# Altium schematic sheet MCU.SchDoc
size 420 x 297 mm; Author: ALTIUM GOSTBOM2.0 KEV; SheetNumber: 2; SheetTotal: 3
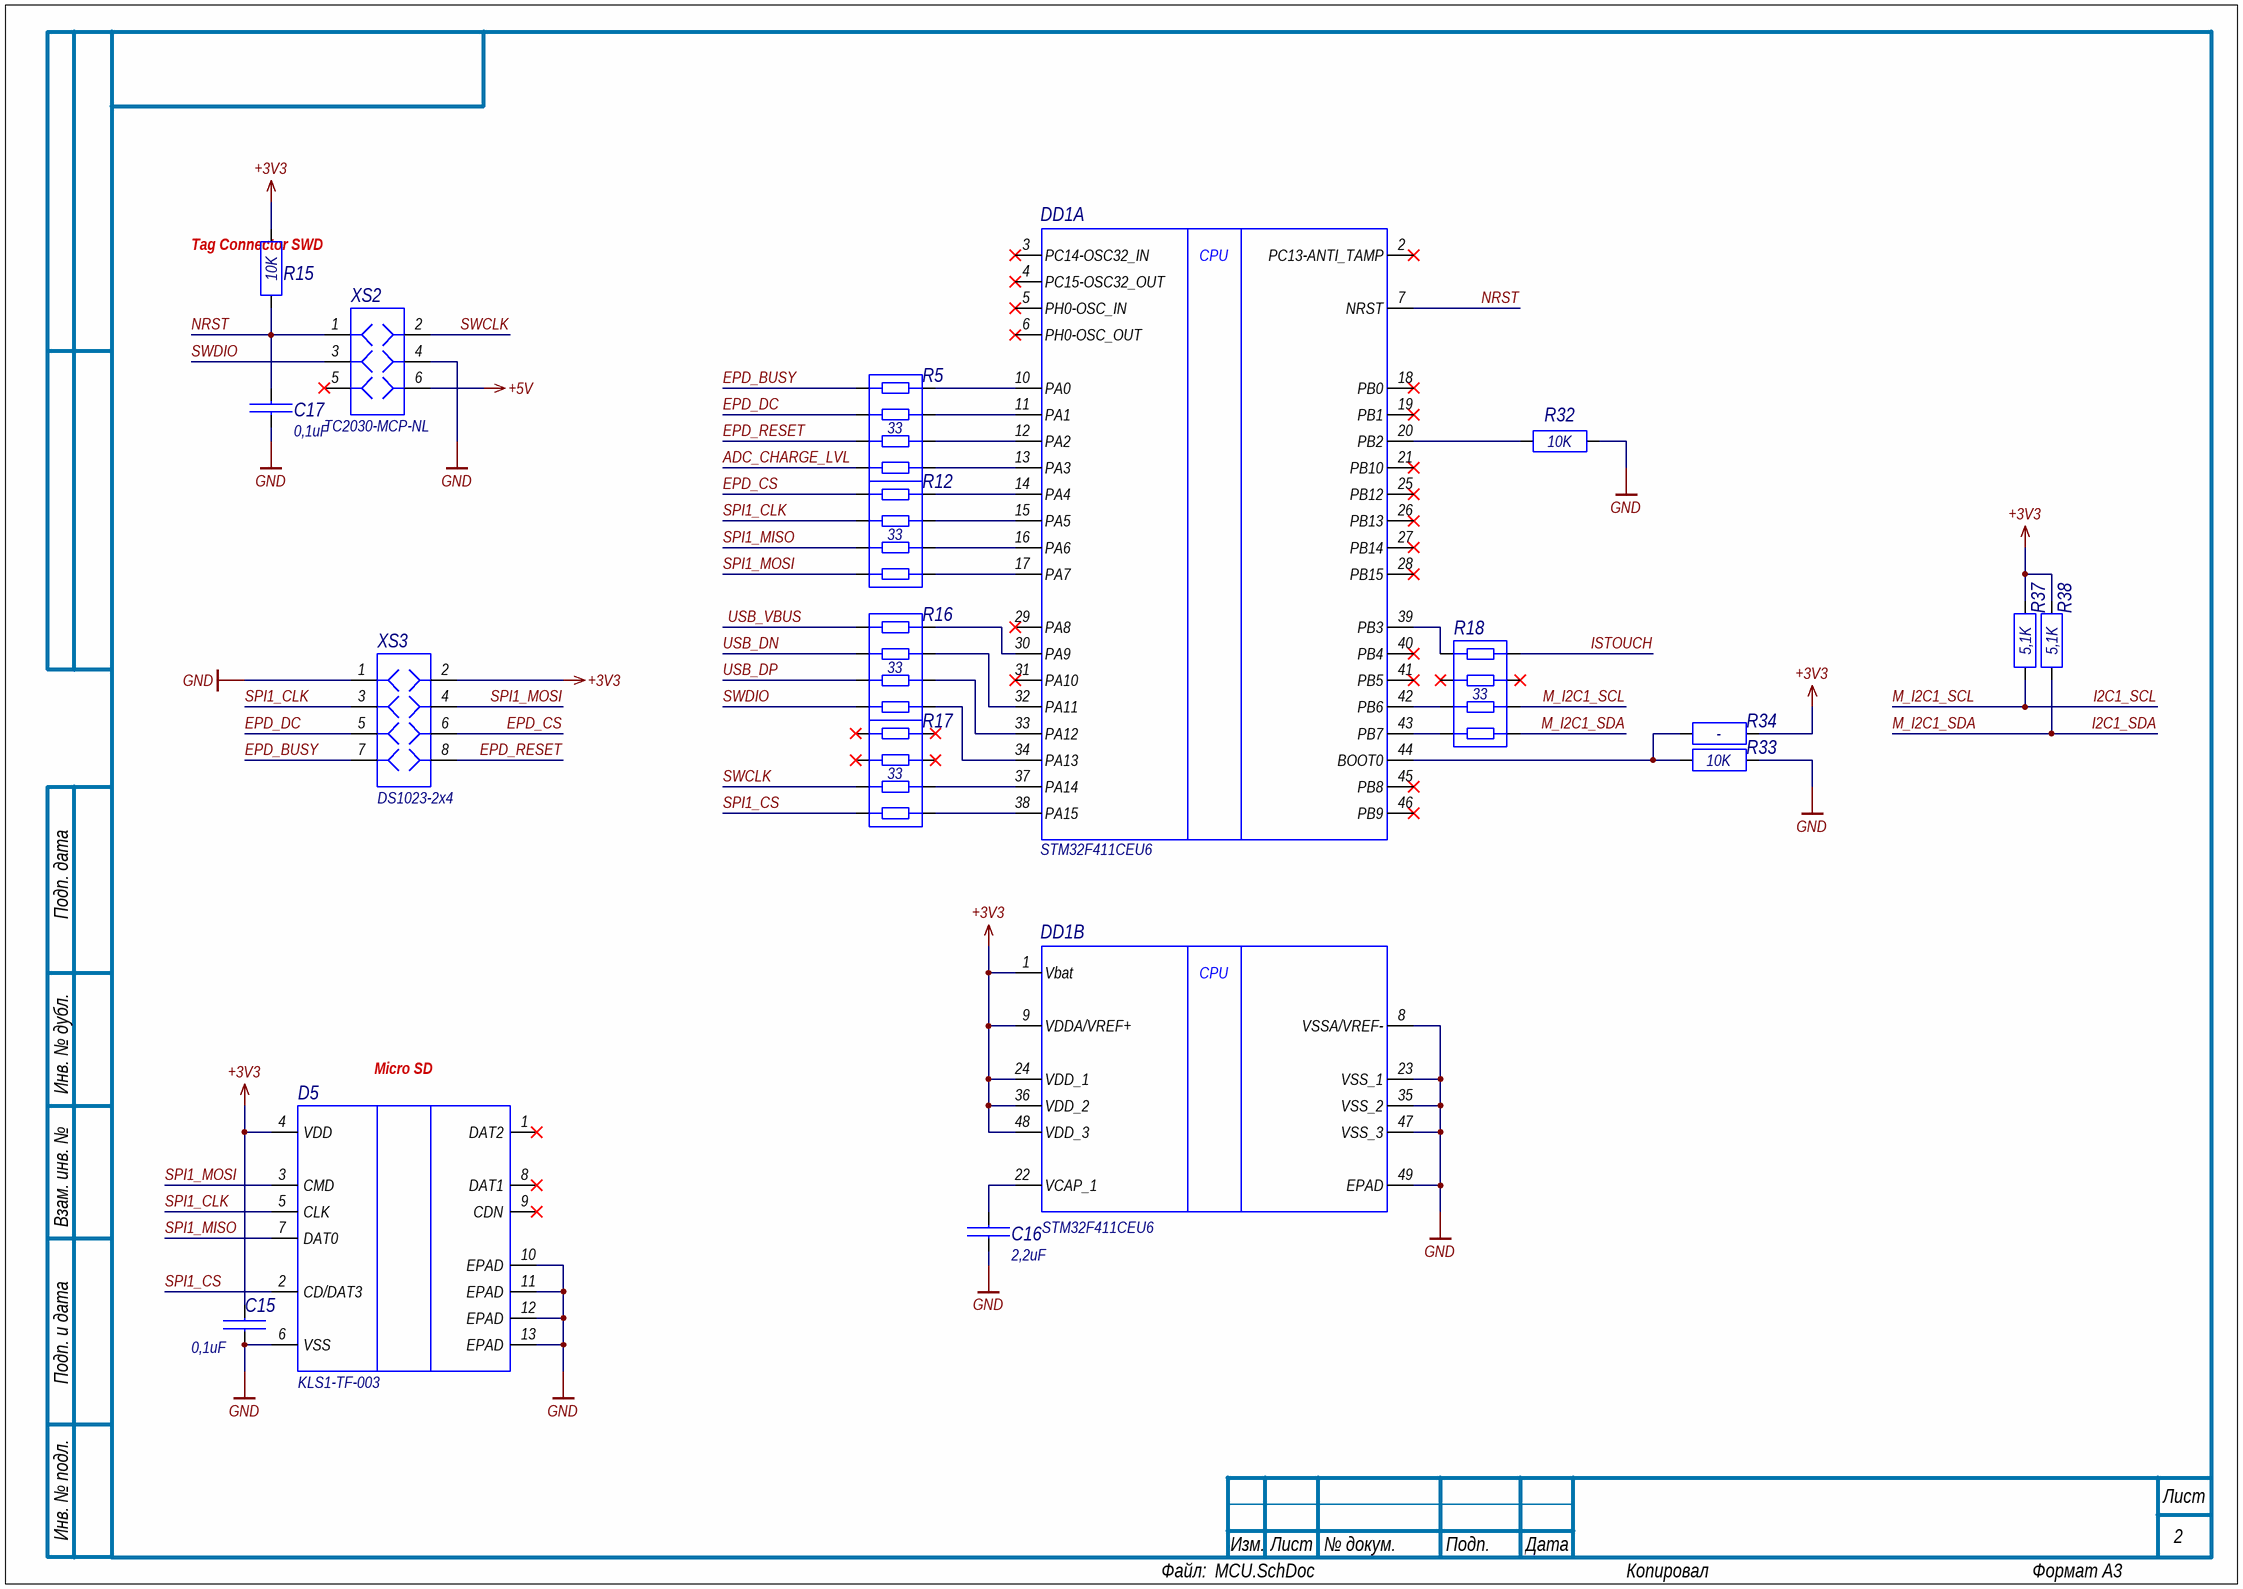
[diagram p0: MCU.SchDoc]

## Parts
C15  value 0,1uF  [CAP_0603]  (hidden comment: CAPACITOR)
C16  value 2,2uF  [CAP_0603]  (hidden comment: CAPACITOR)
C17  value 0,1uF  [CAP_0603]  (hidden comment: CAPACITOR)
D5  KLS1-TF-003  [KLS1-TF-003]
DD1  STM32F411CEU6  [UFQFPN48]  (parts A,B of 2)
R5  value 33  [RES_ARRAY_0804_CONVEX]  (hidden comment: RESISTOR_ARRAY)
R12  value 33  [RES_ARRAY_0804_CONVEX]  (hidden comment: RESISTOR_ARRAY)
R15  value 10K  [RES_0603]  (hidden comment: RESISTOR)
R16  value 33  [RES_ARRAY_0804_CONVEX]  (hidden comment: RESISTOR_ARRAY)
R17  value 33  [RES_ARRAY_0804_CONVEX]  (hidden comment: RESISTOR_ARRAY)
R18  value 33  [RES_ARRAY_0804_CONVEX]  (hidden comment: RESISTOR_ARRAY)
R32  value 10K  [RES_0603]  (hidden comment: RESISTOR)
R33  value 10K  [RES_0603]  (hidden comment: RESISTOR)
R34  RESISTOR  [RES_0603]  (value not drawn)  (no BOM)
R37  value 5,1K  [RES_0603]  (hidden comment: RESISTOR)
R38  value 5,1K  [RES_0603]  (hidden comment: RESISTOR)
XS2  value TC2030-MCP-NL  [TC2030-MCP-NL]  (hidden comment: HEADER-3x2-F)
XS3  value DS1023-2x4  [PBD-8]  (hidden comment: HEADER-4x2-F)

## Nets
+3V3: C15.1 D5.4(VDD) DD1.1(Vbat) DD1.9(VDDA/VREF+) DD1.24(VDD_1) DD1.36(VDD_2) DD1.48(VDD_3) R15.2 R34.2 R37.2 R38.2 XS3.2
+5V: XS2.6
GND: C15.2 C16.2 C17.2 D5.6(VSS) D5.10(EPAD) D5.11(EPAD) D5.12(EPAD) D5.13(EPAD) DD1.8(VSSA/VREF-) DD1.23(VSS_1) DD1.35(VSS_2) DD1.47(VSS_3) DD1.49(EPAD) R32.2 R33.2 XS2.4 XS3.1
ADC_CHARGE_LVL: R5.4
EPD_BUSY: R5.1 XS3.7
EPD_CS: R12.1 XS3.6
EPD_DC: R5.2 XS3.5
EPD_RESET: R5.3 XS3.8
I2C1_SCL: R18.7 R37.1  [also labelled M_I2C1_SCL]
I2C1_SDA: R18.8 R38.1  [also labelled M_I2C1_SDA]
ISTOUCH: R18.5
NRST: C17.1 DD1.7(NRST) R15.1 XS2.1
SPI1_CLK: D5.5(CLK) R12.2 XS3.3
SPI1_CS: D5.2(CD/DAT3) R17.4
SPI1_MISO: D5.7(DAT0) R12.3
SPI1_MOSI: D5.3(CMD) R12.4 XS3.4
SWCLK: R17.3 XS2.2
SWDIO: R16.4 XS2.3
USB_DN: R16.2
USB_DP: R16.3
USB_VBUS: R16.1
NetC16_1: C16.1 DD1.22(VCAP_1)
NetDD1_10: DD1.10(PA0) R5.8
NetDD1_11: DD1.11(PA1) R5.7
NetDD1_12: DD1.12(PA2) R5.6
NetDD1_13: DD1.13(PA3) R5.5
NetDD1_14: DD1.14(PA4) R12.8
NetDD1_15: DD1.15(PA5) R12.7
NetDD1_16: DD1.16(PA6) R12.6
NetDD1_17: DD1.17(PA7) R12.5
NetDD1_20: DD1.20(PB2) R32.1
NetDD1_30: DD1.30(PA9) R16.8
NetDD1_32: DD1.32(PA11) R16.7
NetDD1_33: DD1.33(PA12) R16.6
NetDD1_34: DD1.34(PA13) R16.5
NetDD1_37: DD1.37(PA14) R17.6
NetDD1_38: DD1.38(PA15) R17.5
NetDD1_39: DD1.39(PB3) R18.4
NetDD1_42: DD1.42(PB6) R18.2
NetDD1_43: DD1.43(PB7) R18.1
NetDD1_44: DD1.44(BOOT0) R33.1 R34.1

Not connected (* = marked no-connect by the designer): D5 1(DAT2)* 8(DAT1)* 9(CDN)*; DD1 2(PC13-ANTI_TAMP)* 3(PC14-OSC32_IN)* 4(PC15-OSC32_OUT)* 5(PH0-OSC_IN)* 6(PH0-OSC_OUT)* 18(PB0)* 19(PB1)* 21(PB10)* 25(PB12)* 26(PB13)* 27(PB14)* 28(PB15)* 29(PA8)* 31(PA10)* 40(PB4)* 41(PB5)* 45(PB8)* 46(PB9)*; R17 1* 2* 7* 8*; R18 3* 6*; XS2 5*

## Notes on the sheet
- Tag Connector SWD
- (near D5) Micro SD
- Подп. дата
- Инв. № дубл.
- Взам. инв. №
- Подп. и дата
- Инв. № подл.
- Изм.
- Лист
- № докум.
- Подп.
- Дата
- Файл:
- Копировал
- Формат А3
- (in symbol STM32F411CEU6, part A) CPU
- (in symbol STM32F411CEU6, part B) CPU

## Library data of the parts
C15 C17 = CAP_CER_0603_104_25_10_X7R: Ceramic Capacitor SMD_0603 X7R; Manufacturer: Yageo; Manufacturer Part Number: CC0603KRX7R8BB104; Voltage: 25V; Tolerance: 10%; Part Number: CAP_CER_0603_104_25_10_X7R; Part Type: 0603; Size: 0603; Dielectric: X7R
C16 = CAP_CER_0603_225_10_10_X5R: Ceramic Capacitor SMD_0603 X5R; Manufacturer: Yageo; Manufacturer Part Number: CC0603KRX5R6BB225; Voltage: 10V; Tolerance: 10%; Part Number: CAP_CER_0603_225_10_10_X5R; Part Type: 0603; Size: 0603; Dielectric: X5R
D5 = KLS1-TF-003: microSD Card Connector; Manufacturer: KLS; Value: KLS1-TF-003; Part Number: KLS1-TF-003; Part Type: CARD; Manufacturer Part Number: KLS1-TF-003
DD1 = STM32F411CEU6: Arm Cortex-M4 32b MCU+FPU, 125 DMIPS, 512KB Flash, / 128KB RAM, USB OTG FS, 11 TIMs, 1 ADC, 13 comm. interfaces; Manufacturer_Name: STMicroelectronics; Geometry.Height: 0.6mm; Manufacturer_Part_Number: STM32F411CEU6; Mouser Part Number: 511-STM32F411CEU6; Mouser Price/Stock: https://www.mouser.co.uk/ProductDetail/STMicroelectronics/STM32F411CEU6?qs=pjMTYa9MTGV3ou31YBFa3g%3D%3D; Arrow Part Number: STM32F411CEU6; Arrow Price/Stock: https://www.arrow.com/en/products/stm32f411ceu6/stmicroelectronics?utm_currency=USD&region=nac; Datasheet Link: http://www.st.com/content/ccc/resource/technical/document/datasheet/b3/a5/46/3b/b4/e5/4c/85/DM00115249.pdf/files/DM00115249.pdf/jcr:content/translations/en.DM00115249.pdf; Part Number: STM32F411CEU6; Part Type: MCU; Value: STM32F411CEU6; Size: UFQFPN48; Manufacturer: STMicroelectronics; Manufacturer Part Number: STM32F411CEU6
R5 R12 R16-R18 = RES_ARR_CAY10_33R: CAY10 Series - Chip Resistor Array; Manufacturer: Yageo; Manufacturer Part Number: YC124-JR-0733RL; Tolerance: 5%; Power: 31mW; Replace: CAY10-330J4LF; Part Number: RES_ARR_CAY10_33R; Part Type: ARRAY; Size: 0804
R15 R32-R34 = RES_SMD_0603_10K_5%: Resistor fixed SMD_0603 5%; Manufacturer: Yageo; Manufacturer Part Number: RC0603JR-0710KL; Power: 100mW; Part Number: RES_SMD_0603_10K_5%; Part Type: 0603; Tolerance: 5%; Size: 0603
  R34: Value: -
R37 R38 = RES_SMD_0603_5K1_5%: Resistor fixed SMD_0603 5%; Manufacturer: Yageo; Manufacturer Part Number: RC0603JR-075K1L; Power: 100mW; Part Number: RES_SMD_0603_5K1_5%; Part Type: 0603; Tolerance: 5%; Size: 0603
XS2 = TC2030-MCP-NL: Tag connector 2x3; Part Number: TC2030-MCP-NL; Part Type: HEADER; Manufacturer: Tag Connect; Manufacturer Part Number: TC2030-MCP-NL
XS3 = PBD-8: Female Socket Header Through Hole 8 (2x4) Position 0.100" (2.54mm); Manufacturer: Connfly; Manufacturer Part Number: DS1023-2x4S21; Part Number: PBD-8; Part Type: HEADER; Replace: PBD-8